# Altium schematic sheet Sheet_1_.schdoc
size 308 x 177 mm
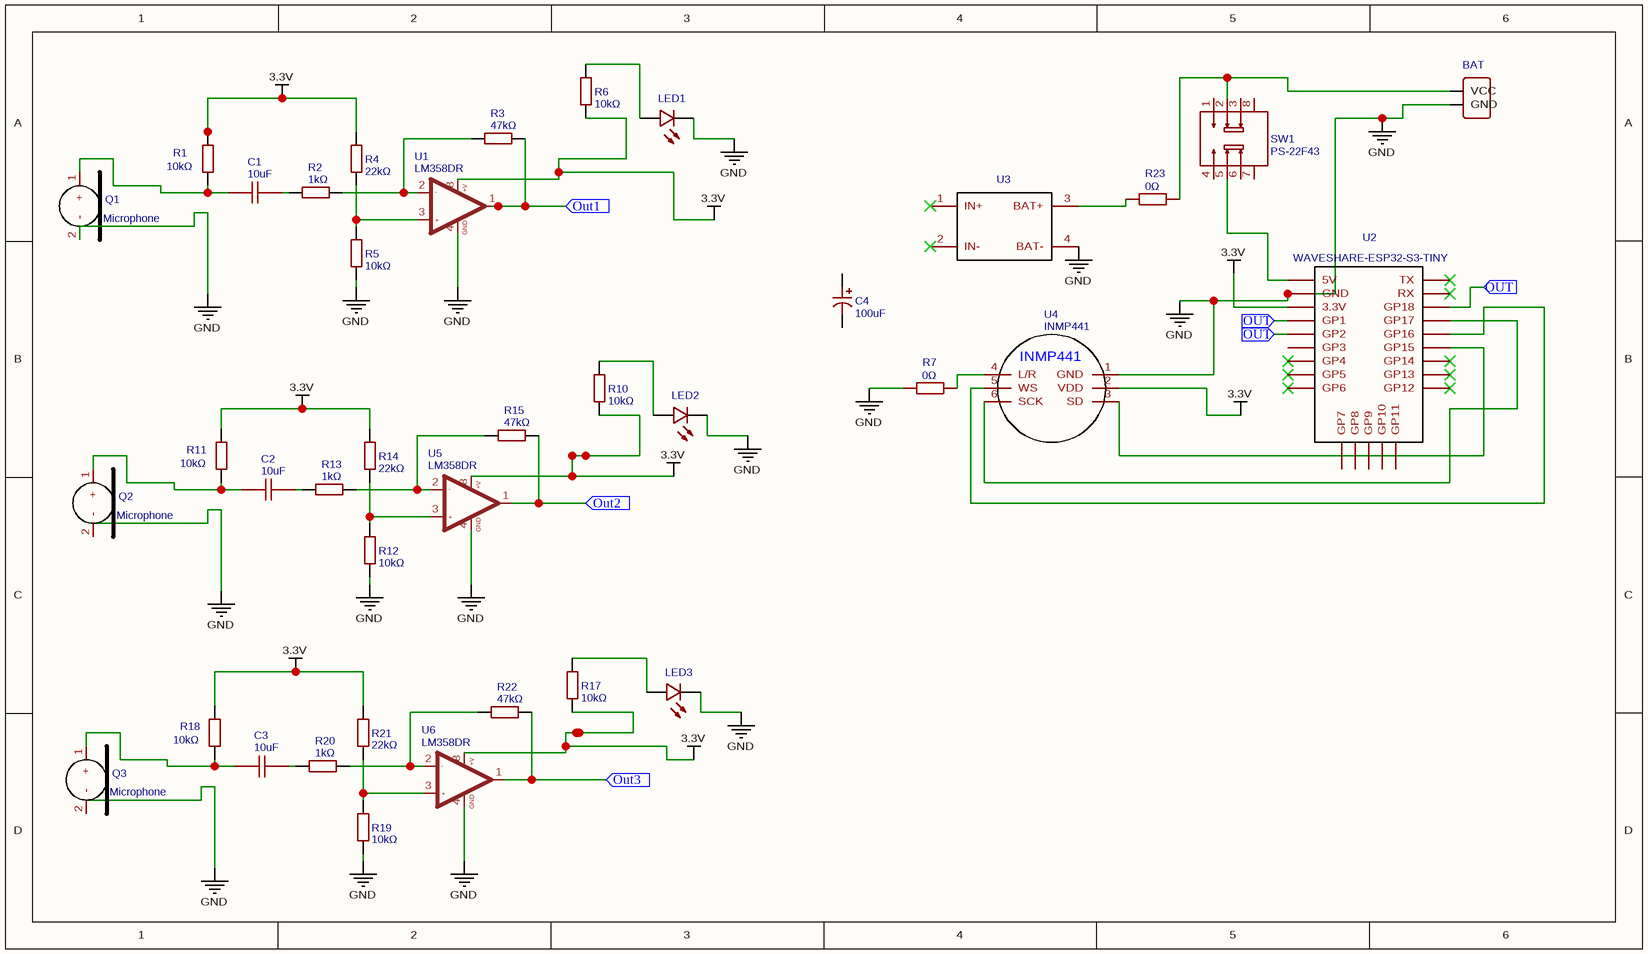
[diagram p0: Sheet_1_.schdoc]

## Parts
BAT  HDR-F-2.54_1x2  [HDR-F-2.54_1X2]  (value not drawn)
C1  10uF  [C0805]
C2  10uF  [C0805]
C3  10uF  [C0805]
C4  100uF  [CAP-SMD_BD6.3-L6.6-W6.6-LS7.2-FD]
LED1  19-217/BHC-ZL1M2RY/3T  [LED0603-RD]  (value not drawn)
LED2  19-217/BHC-ZL1M2RY/3T  [LED0603-RD]  (value not drawn)
LED3  19-217/BHC-ZL1M2RY/3T  [LED0603-RD]  (value not drawn)
Q1  Microphone  [MICROPHONE]
Q2  Microphone  [MICROPHONE]
Q3  Microphone  [MICROPHONE]
R1  10kΩ  [R0402]
R2  1kΩ  [R0402]
R3  47kΩ  [R0402]
R4  22kΩ  [R0402]
R5  10kΩ  [R0402]
R6  10kΩ  [R0402]
R7  0Ω  [R2010]
R10  10kΩ  [R0402]
R11  10kΩ  [R0402]
R12  10kΩ  [R0402]
R13  1kΩ  [R0402]
R14  22kΩ  [R0402]
R15  47kΩ  [R0402]
R17  10kΩ  [R0402]
R18  10kΩ  [R0402]
R19  10kΩ  [R0402]
R20  1kΩ  [R0402]
R21  22kΩ  [R0402]
R22  47kΩ  [R0402]
R23  0Ω  [R2010]
SW1  PS-22F43  [SW-TH_PS-22F43XXX]
U1  LM358DR  [SOIC-8_L5.0-W4.0-P1.27-LS6.0-BL]
U2  WAVESHARE-ESP32-S3-TINY  [WAVESHARE-ESP32-S3-TINY]
U3  Battery Protection  tp4056  [TP4056E]  (value not drawn)
U4  INMP441  [INMP441]
U5  LM358DR  [SOIC-8_L5.0-W4.0-P1.27-LS6.0-BL]
U6  LM358DR  [SOIC-8_L5.0-W4.0-P1.27-LS6.0-BL]

## Ports
Out1 (in), Out2 (in), Out3 (in), OUT (in)

## Nets
3.3V: R1.2 R4.2 R6.1 R10.1 R11.2 R14.2 R17.1 R18.2 R21.2 U1.8(+V) U2.3(3.3V) U4.2(VDD) U5.8(+V) U6.8(+V)
GND: BAT.2(GND) LED1.1(C) LED2.1(C) LED3.1(C) Q1.2(-) Q2.2(-) Q3.2(-) R5.1 R7.1 R12.1 R19.1 U1.4(GND) U2.2(GND) U3.4(BAT-) U4.1(GND) U5.4(GND) U6.4(GND)
OUT: U2.4(GP1) U2.5(GP2) U2.21(GP18) ; port OUT
Out1: R3.2 U1.1(OUT1) ; port Out1
Out2: R15.2 U5.1(OUT1) ; port Out2
Out3: R22.2 U6.1(OUT1) ; port Out3
NetBAT_1: BAT.1(VCC) R23.2 SW1.2
NetC1_1: C1.1 Q1.1(+) R1.1
NetC1_2: C1.2 R2.1
NetC2_1: C2.1 Q2.1(+) R11.1
NetC2_2: C2.2 R13.1
NetC3_1: C3.1 Q3.1(+) R18.1
NetC3_2: C3.2 R20.1
NetLED1_2: LED1.2(A) R6.2
NetLED2_2: LED2.2(A) R10.2
NetLED3_2: LED3.2(A) R17.2
NetR2_2: R2.2 R3.1 U1.2(-IN1)
NetR4_1: R4.1 R5.2 U1.3(+IN1)
NetR7_2: R7.2 U4.4(L/R)
NetR12_2: R12.2 R14.1 U5.3(+IN1)
NetR13_2: R13.2 R15.1 U5.2(-IN1)
NetR19_2: R19.2 R21.1 U6.3(+IN1)
NetR20_2: R20.2 R22.1 U6.2(-IN1)
NetR23_1: R23.1 U3.3(BAT+)
NetSW1_5: SW1.5 U2.1(5V)
NetU2_18: U2.18(GP15) U4.3(SD)
NetU2_19: U2.19(GP16) U4.5(WS)
NetU2_20: U2.20(GP17) U4.6(SCK)

Not connected (* = marked no-connect by the designer): C4 1 2; SW1 1 3 4 6 7 8; U2 6(GP3) 7(GP4)* 8(GP5)* 9(GP6)* 10(GP7) 11(GP8) 12(GP9) 13(GP10) 14(GP11) 15(GP12)* 16(GP13)* 17(GP14)* 22(RX)* 23(TX)*; U3 1(IN+)* 2(IN-)*

## Notes on the sheet
- (in symbol LM358DR) -; +

## Library data of the parts
BAT = HDR-F-2.54_1x2: Contributor: LCEDA_Lib; Supplier Part: C49661; Supplier: LCSC; spicePre: H; spiceSymbolName: HDR-F-2.54_1x2
C1-C3 = 10uF: Manufacturer Part: CL21A106KAYNNNE; Manufacturer: SAMSUNG(三星); nameAlias: Value; Supplier: LCSC; Supplier Part: C15850; spicePre: C; spiceSymbolName: CL21A106KAYNNNE
C4 = 100uF: Manufacturer: KNSCHA(科尼盛); Manufacturer Part: RVT100UF16V67RV0016; nameAlias: Value; Contributor: LCSC; Supplier: LCSC; Supplier Part: C2887276; JLCPCB Part Class: Extended Part; spicePre: C; spiceSymbolName: RVT100UF16V67RV0016
LED1-LED3 = 19-217/BHC-ZL1M2RY/3T: Manufacturer: EVERLIGHT(亿光); Supplier: LCSC; Manufacturer Part: 19-217/BHC-ZL1M2RY/3T; Supplier Part: C72041; JLCPCB Part Class: Basic Part; spicePre: L; spiceSymbolName: 19-217/BHC-ZL1M2RY/3T
Q1-Q3 = Microphone: Contributor: Мастерская Ленара; spicePre: Q; spiceSymbolName: Microphone
R1 R5 R6 R10-R12 R17-R19 = 10kΩ: Manufacturer: YAGEO(国巨); Manufacturer Part: RC0402FR-0710KL; nameAlias: Value; Supplier: LCSC; Supplier Part: C60490; JLCPCB Part Class: Extended Part; spicePre: R; spiceSymbolName: RC0402FR-0710KL
R2 R13 R20 = 1kΩ: Manufacturer: UNI-ROYAL(厚声); Manufacturer Part: 0402WGF1001TCE; nameAlias: Value; Supplier: LCSC; Supplier Part: C11702; JLCPCB Part Class: Basic Part; spicePre: R; spiceSymbolName: 0402WGF1001TCE
R3 R15 R22 = 47kΩ: Manufacturer: UNI-ROYAL(厚声); Manufacturer Part: 0402WGF4702TCE; nameAlias: Value; Supplier: LCSC; Supplier Part: C25792; JLCPCB Part Class: Basic Part; spicePre: R; spiceSymbolName: 0402WGF4702TCE
R4 R14 R21 = 22kΩ: Manufacturer: UNI-ROYAL(厚声); Manufacturer Part: 0402WGF2202TCE; nameAlias: Value; Supplier: LCSC; Supplier Part: C25768; JLCPCB Part Class: Basic Part; spicePre: R; spiceSymbolName: 0402WGF2202TCE
R7 R23 = 0Ω: Manufacturer: UNI-ROYAL(厚声); Manufacturer Part: 201007F0000T4E; nameAlias: Value; Contributor: LCSC; Supplier: LCSC; Supplier Part: C270974; JLCPCB Part Class: Extended Part; spicePre: R; spiceSymbolName: 201007F0000T4E
SW1 = PS-22F43: Manufacturer: G-Switch(品赞); Contributor: lcsc; Supplier: LCSC; Supplier Part: C2848951; Manufacturer Part: PS-22F43; JLCPCB Part Class: Extended Part; link: https://lcsc.com/eda_search?q=C2848951&%26type=1&ref=editor; spicePre: U; spiceSymbolName: PS-22F43
U1 U5 U6 = LM358DR: subpart_no: 1; Manufacturer: TI(德州仪器); tags: General Operational Amplifier; sourceId: LDdaKIigs; SMT Type: Extend; SeeedStudio: 310020021; timeStamp: 1448067236; image: http://image.lceda.cn/szlcsc/C5423.jpg; Supplier Part: C5423; Supplier: LCSC; Manufacturer Part: LM358DR; LCSC Assembly: Yes; JLCPCB Part Class: Extended Part; spicePre: U; spiceSymbolName: LM358DR
U2 = WAVESHARE-ESP32-S3-TINY: Manufacturer Part: ESP32-S3 Mini Development Board; Contributor: Mohammed Jerjawi; Manufacturer: WAVESHARE; Supplier: WAVESHARE; link: https://www.waveshare.com/product/esp32-s3-tiny.htm; spicePre: U; spiceSymbolName: WAVESHARE-ESP32-S3-TINY
U3 = Battery Protection  tp4056: Contributor: gxgx; Manufacturer Part: Battery Protection  tp4056; spicePre: U; spiceSymbolName: Battery Protection  tp4056
U4 = INMP441: Manufacturer: Ali; Contributor: Guest; Supplier Part: INMP441; link: https://nl.aliexpress.com/item/4000045517597.html?spm=a2g0o.productlist.main.5.2562Yi3jYi3jRf&algo_pvid=960b0d6b-e994-44b3-b9cd-0562ed748b67&algo_exp_id=960b0d6b-e994-44b3-b9cd-0562ed748b67-2&pdp_npi=4%40dis%21EUR%211.41%211.41%21%21%211.51%21%21%402103864c17010856231954356e172e%2110000000102343474%21sea%21NL%214758353868%21&curPageLogUid=fAm7ZpY7ht13; spicePre: U; spiceSymbolName: INMP441